# EAGLE design dimmerPower (EAGLE 9.2.0)
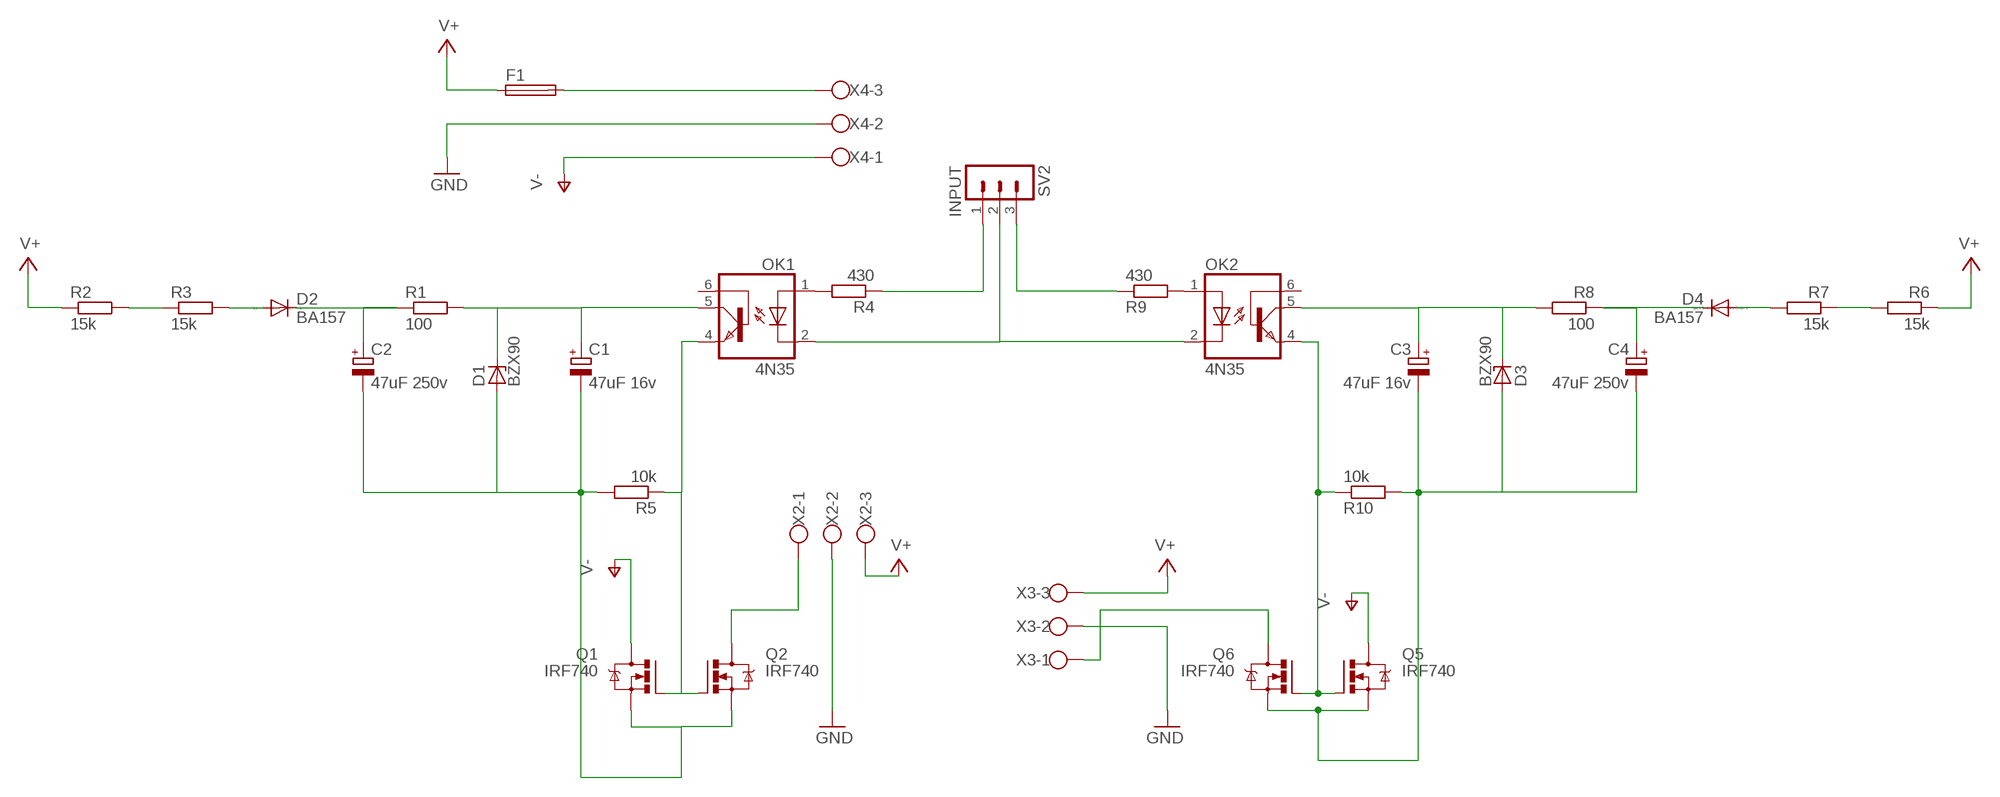
[diagram p0: schematic, sheet 1]

## Parts
C1  47uF 16v  CPOL-EUE2.5-6  [E2,5-6]
C2  47uF 250v  CPOL-EUE5-13  [E5-13]
C3  47uF 16v  CPOL-EUE2.5-6  [E2,5-6]
C4  47uF 250v  CPOL-EUE5-13  [E5-13]
D1  BZX90  [DO34Z7]
D2  BA157  [P1-10]
D3  BZX90  [DO34Z7]
D4  BA157  [P1-10]
F1  SH22,5  [SH22,5]
OK1  4N35  [DIL06]
OK2  4N35  [DIL06]
Q1  IRF740  [TO220BV]
Q2  IRF740  [TO220BV]
Q5  IRF740  [TO220BV]
Q6  IRF740  [TO220BV]
R1  100  R-EU_0204/7  [0204/7]
R2  15k  R-EU_0613/15  [P0613/15]
R3  15k  R-EU_0613/15  [P0613/15]
R4  430  R-EU_0204/7  [0204/7]
R5  10k  R-EU_0204/7  [0204/7]
R6  15k  R-EU_0613/15  [P0613/15]
R7  15k  R-EU_0613/15  [P0613/15]
R8  100  R-EU_0204/7  [0204/7]
R9  430  R-EU_0204/7  [0204/7]
R10  10k  R-EU_0204/7  [0204/7]
SV2  INPUT  MA03-1  [MA03-1]
X2  W237-103  [W237-103]
X3  W237-103  [W237-103]
X4  W237-103  [W237-103]

## Nets
GND: X2.2 X3.2 X4.2
N$1: Q6.D X3.1
N$2: OK1.2(C) OK2.2(C) SV2.2
N$3: OK1.1(A) R4.2
N$5: C3.- C4.- D3.A Q5.S Q6.S R10.2
N$6: C1.- C2.- D1.A Q1.S Q2.S R5.2
N$7: R2.2 R3.1
N$8: D2.A R3.2
N$9: C2.+ D2.C R1.1
N$10: C1.+ D1.C OK1.5(COL) R1.2
N$11: R4.1 SV2.1
N$12: Q2.D X2.1
N$13: R6.2 R7.1
N$14: D4.A R7.2
N$15: C4.+ D4.C R8.1
N$16: C3.+ D3.C OK2.5(COL) R8.2
N$17: R9.1 SV2.3
N$19: OK2.1(A) R9.2
N$20: OK1.4(EMI) Q1.G Q2.G R5.1
N$22: OK2.4(EMI) Q5.G Q6.G R10.1
V+: F1.1 R2.1 R6.1 X2.3 X3.3
V+1: F1.2 X4.3
V-: Q1.D Q5.D X4.1
Unconnected: OK1.6(BAS) OK2.6(BAS)

## Library data of the parts
C1-C4 = rcl:CPOL-EU: POLARIZED CAPACITOR, European symbol; SPICEPREFIX: C
D1 D3 = diode:BZX90: Z DIODE
D2 D4 = diode:BA157: DIODE fast soft-recovery controlled avalanche rectifier
F1 = fuse:SH22,5: FUSE HOLDER grid 22,5 mm, OGN0031 8201, Schurter (Buerklin); MF: SCHURTER; MPN: 0031.8201; OC_FARNELL: 1162740; OC_NEWARK: 96F8317
OK1 OK2 = optocoupler:4N35: MOTOROLA OPTO COUPLER; MF: FAIRCHILD SEMICONDUCTOR; MPN: 4N35; OC_FARNELL: 1328375; OC_NEWARK: 72K9946
Q1 Q2 Q5 Q6 = transistor-power:IRF740: N-CHANNEL MOS FET
R1-R10 = rcl:R-EU_: RESISTOR, European symbol; SPICEPREFIX: R
SV2 = con-lstb:MA03-1: PIN HEADER; OC_FARNELL: unknown; OC_NEWARK: unknown
X2-X4 = con-wago-500:W237-103: WAGO SCREW CLAMP; MPN: 237-103; OC_FARNELL: unknown; OC_NEWARK: 18M7116

## Board
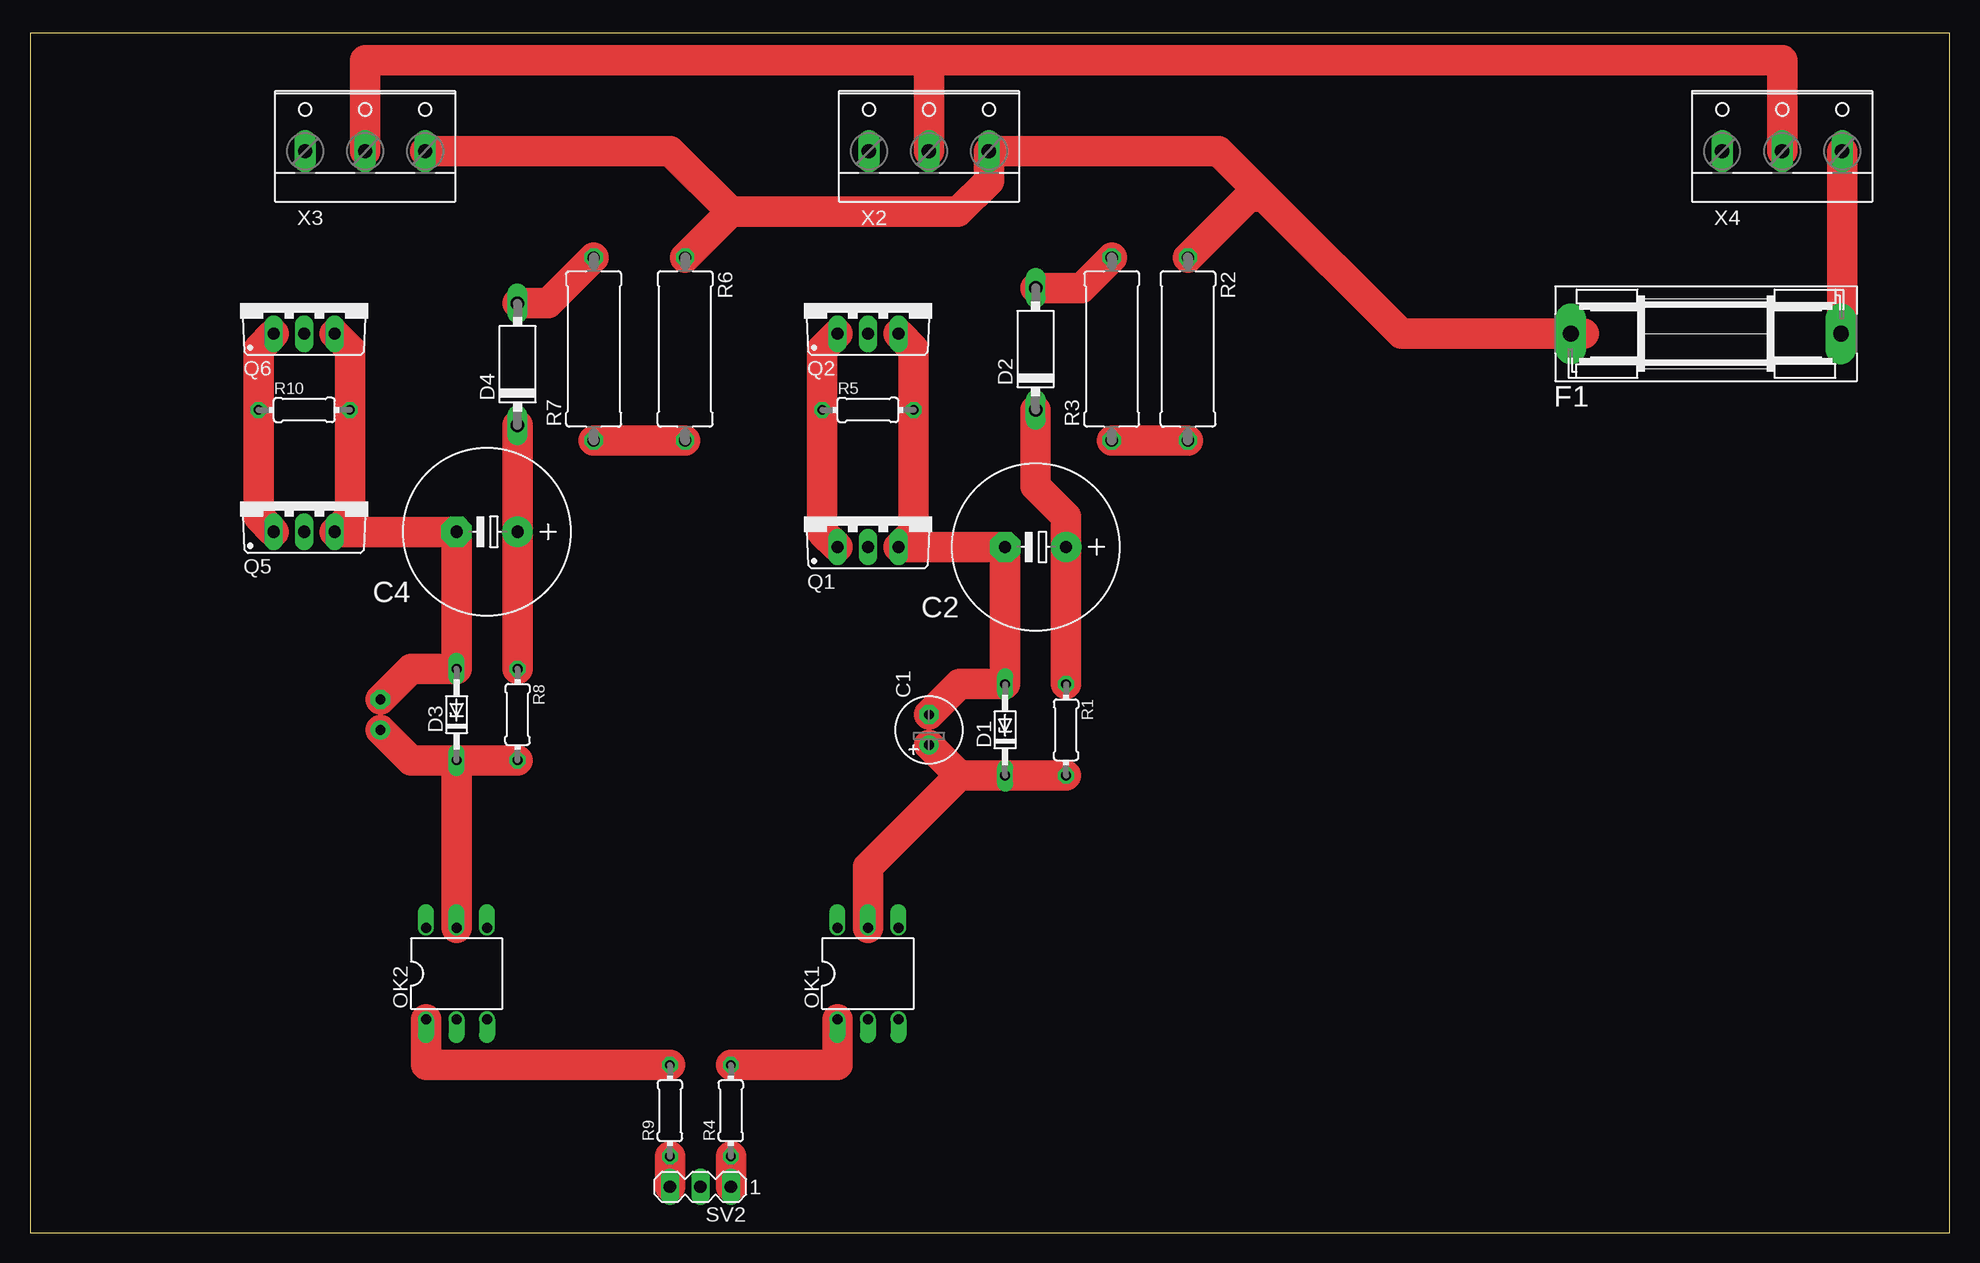
[diagram p1: board, top side]
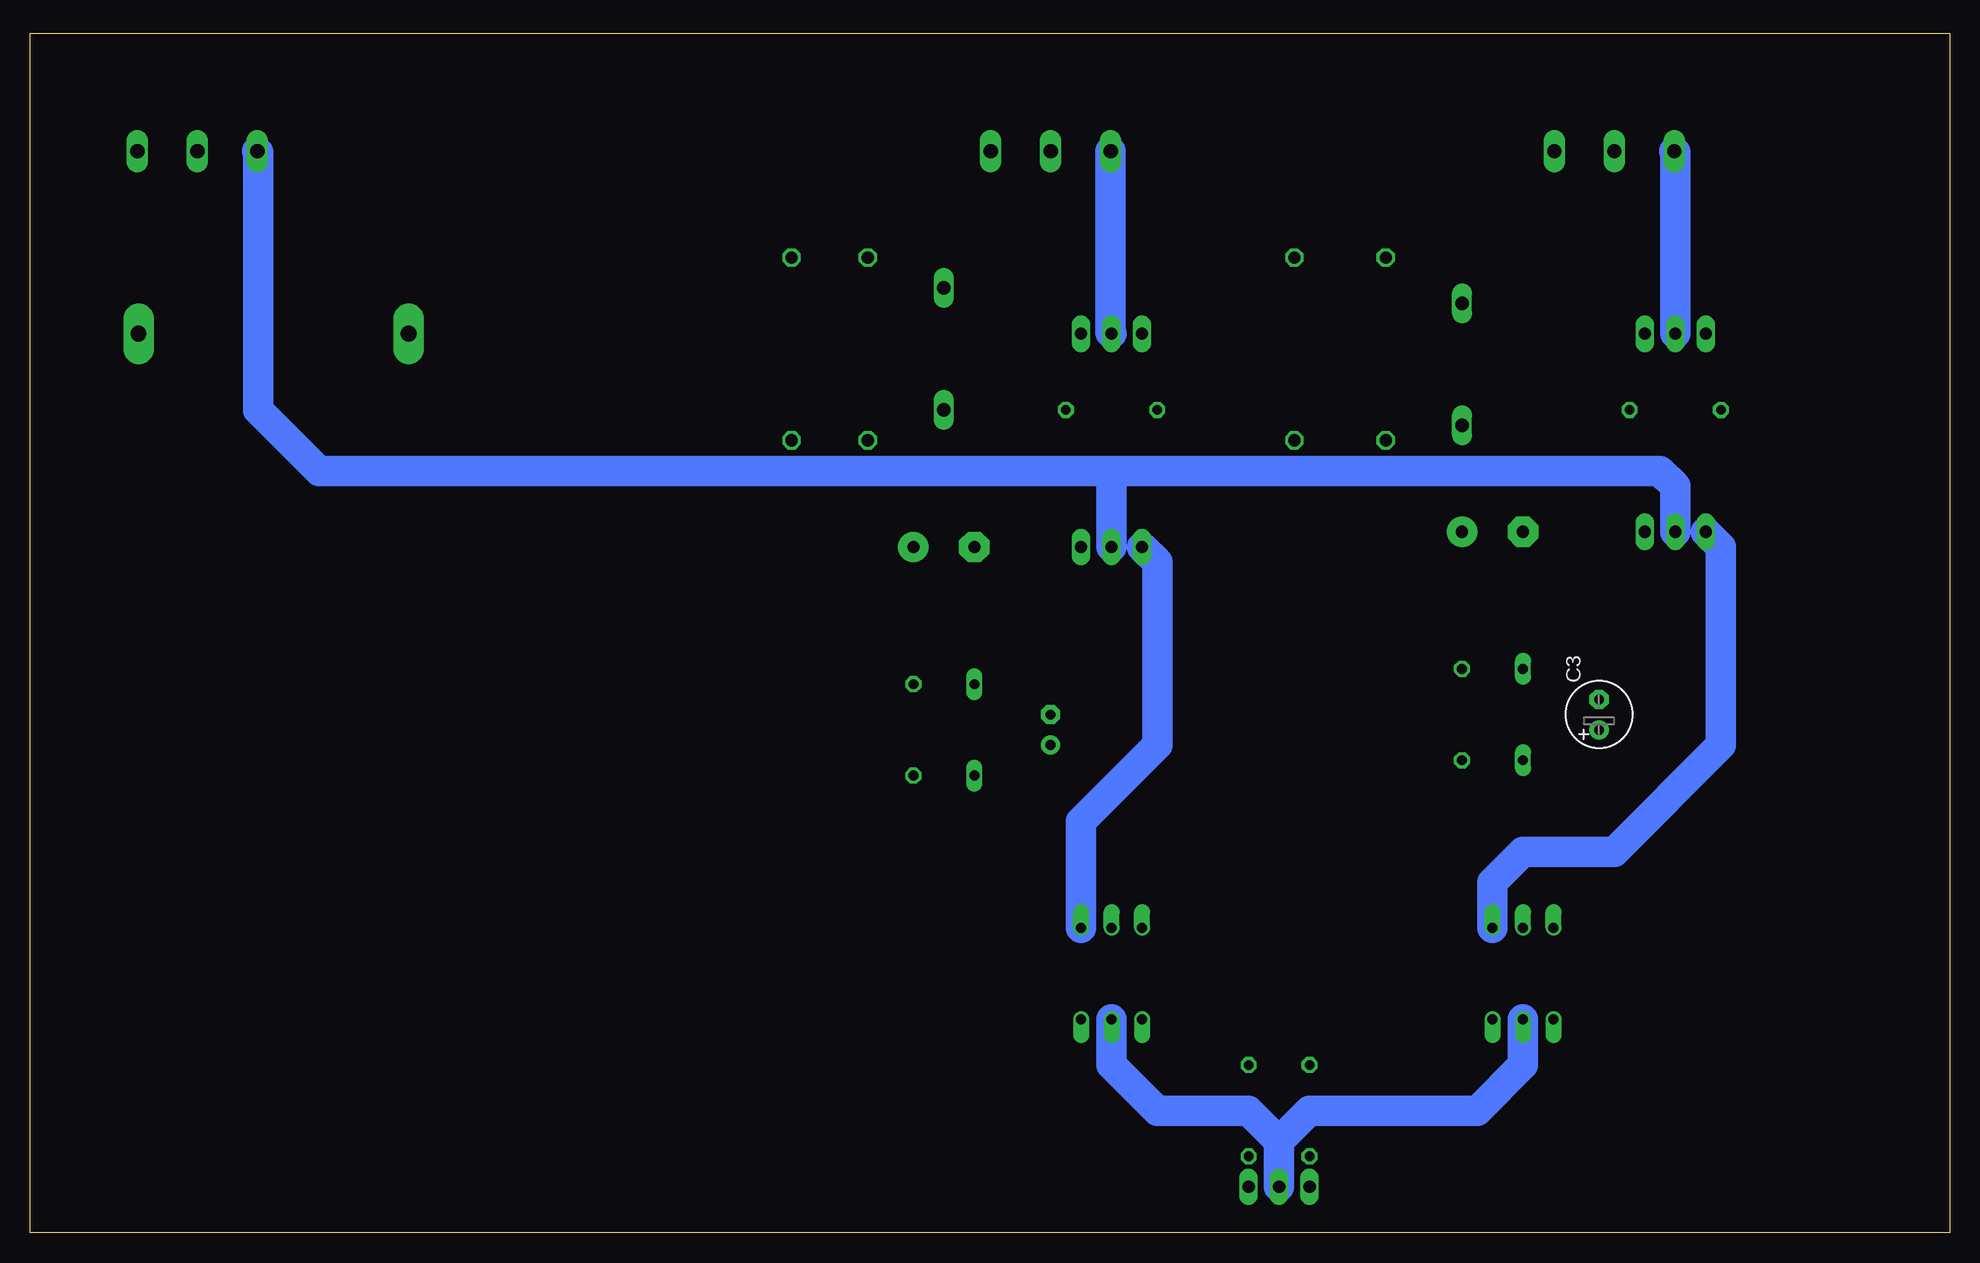
[diagram p2: board, bottom side, seen from below]

Size 160 x 100 mm. Coordinates in mm from the lower left corner, seen from the top.
Outline: 0,0 160,0 160,100 0,100 0,0
Copper layers (1*16): Top 0.035mm / dielectric 1.5mm / Bottom 0.035mm
Design rules "default *": minimum track width 100mil, minimum drill 0.35mm, track to track 6mil, track to pad 6mil, pad to pad 6mil, via to via 6mil, smd to smd 6mil, copper to edge 40mil, drill to drill 6mil, minimum pad ring 10mil, minimum via ring 8mil, stop-mask expansion 4mil, vias tented up to drill 0mil, thermal gap 10mil

### Footprints (pad centres in the part's own frame; a part is rotated, then mirrored left to right if it is on the bottom)
E2,5-6 = drill 0.813 pad 1.6: + -1.27,0 | drill 0.813 pad 1.6 octagon: - 1.27,0
E5-13 = drill 1.016 pad 2.54: + -2.54,0 | drill 1.016 pad 2.54 octagon: - 2.54,0
DO34Z7 = drill 0.813 long: A 3.81,0; C -3.81,0
P1-10 = drill 1.118 long: A 5.08,0; C -5.08,0
SH22,5 = drill 1.321 pad 2.54 long: 1 -11.252,0; 2 11.252,0
DIL06 = drill 0.813 offset: 1 -2.54,-3.81; 2 0,-3.81; 3 2.54,-3.81; 4 2.54,3.81; 5 0,3.81; 6 -2.54,3.81
TO220BV = drill 1.016 long: D 0,-2.54; G -2.54,-2.54; S 2.54,-2.54
0204/7 = drill 0.813 octagon: 1 -3.81,0; 2 3.81,0
P0613/15 = drill 1.016 octagon: 1 -7.62,0; 2 7.62,0
MA03-1 = drill 1.016 long: 1 -2.54,0; 2 0,0; 3 2.54,0
W237-103 = drill 1.194 long: 1 -5,-1.29; 2 0,-1.29; 3 5,-1.29

### Placement (x,y rotation side)
C1  74.93,41.91 90 top
C2  83.82,57.15 180 top
C3  29.21,43.18 90 bottom
C4  38.1,58.42 180 top
D1  81.28,41.91 90 top
D2  83.82,73.66 90 top
D3  35.56,43.18 90 top
D4  40.64,72.39 90 top
F1  139.7,74.93 0 top
OK1  69.85,21.59 0 top
OK2  35.56,21.59 0 top
Q1  69.85,59.69 0 top
Q2  69.85,77.47 0 top
Q5  22.86,60.96 0 top
Q6  22.86,77.47 0 top
R1  86.36,41.91 270 top
R2  96.52,73.66 270 top
R3  90.17,73.66 90 top
R4  58.42,10.16 90 top
R5  69.85,68.58 0 top
R6  54.61,73.66 270 top
R7  46.99,73.66 90 top
R8  40.64,43.18 270 top
R9  53.34,10.16 90 top
R10  22.86,68.58 0 top
SV2  55.88,3.81 180 top
X2  74.93,91.44 0 top
X3  27.94,91.44 0 top
X4  146.05,91.44 0 top

### Tracks (layer width: path | path; a pad name or v marks a point on that pad's centre or on a via)
GND
  Top 2.54: 74.93,97.71 27.94,97.71 X3.2 | X4.2 146.05,97.71 74.93,97.71 | 74.93,97.71 X2.2
N$1
  Bottom 2.54: Q6.D 22.86,90.07 X3.1
N$2
  Bottom 2.54: 55.88,7.62 58.42,10.16 66.04,10.16 69.85,13.97 OK1.2 | SV2.2 55.88,7.62 | 55.88,7.62 53.34,10.16 39.37,10.16 35.56,13.97 OK2.2
N$3
  Top 2.54: R4.2 67.31,13.97 OK1.1
N$5
  Top 2.54: Q6.S 26.67,73.66 R10.2 26.67,59.69 Q5.S C4.- D3.A 31.75,46.99 C3.-
N$6
  Top 2.54: Q2.S 73.66,73.66 R5.2 73.66,58.42 Q1.S C2.- D1.A 77.47,45.72 C1.-
N$7
  Top 2.54: R3.1 R2.2
N$8
  Top 2.54: R3.2 87.63,78.74 D2.A
N$9
  Top 2.54: R1.1 C2.+ 86.36,59.69 83.82,62.23 D2.C
N$10
  Top 2.54: C1.+ 77.47,38.1 | 77.47,38.1 D1.C R1.2 | OK1.5 69.85,30.48 77.47,38.1
N$11
  Top 2.54: SV2.1 R4.1
N$12
  Bottom 2.54: X2.1 69.93,75.01 Q2.D
N$13
  Top 2.54: R7.1 R6.2
N$14
  Top 2.54: R7.2 43.18,77.47 D4.A
N$15
  Top 2.54: D4.C C4.+ R8.1
N$16
  Top 2.54: D3.C R8.2 | C3.+ 31.75,39.37 D3.C | D3.C OK2.5
N$17
  Top 0.152: SV2.3 53.34,4.02
  Top 2.54: SV2.3 R9.1
N$19
  Top 2.54: OK2.1 33.02,13.97 R9.2
N$20
  Top 2.54: Q2.G 66.04,73.66 R5.1 66.04,58.42 Q1.G
  Bottom 0.152: R5.1 65.99,68.68
  Bottom 2.54: Q1.G 66.04,55.88 66.04,40.64 72.39,34.29 OK1.4
N$22
  Top 2.54: Q5.G 19.05,59.69 R10.1 19.05,73.66 Q6.G
  Bottom 2.54: Q5.G 19.05,57.15 19.05,40.64 27.94,31.75 35.56,31.75 38.1,29.21 OK2.4
V+
  Top 0.152: 96.57,81.33 R2.1 | 33.07,90.07 X3.3
  Top 2.54: 32.96,90.17 X3.3 53.36,90.15 58.42,85.09 | X2.3 79.95,90.17 | X2.3 79.93,87.65 77.37,85.09 58.42,85.09 | 58.42,85.09 R6.1 | X2.3 99.08,90.15 102.87,86.36 | 129.54,74.93 F1.1 114.3,74.93 102.87,86.36 | R2.1 101.6,86.36 102.87,86.36
V+1
  Top 2.54: F1.2 151.05,74.93 X4.3
V-
  Bottom 2.54: X4.1 140.97,90.07 140.97,68.58 135.89,63.5 69.85,63.5 | 69.85,63.5 24.13,63.5 22.86,62.23 Q5.D | 69.85,63.5 Q1.D